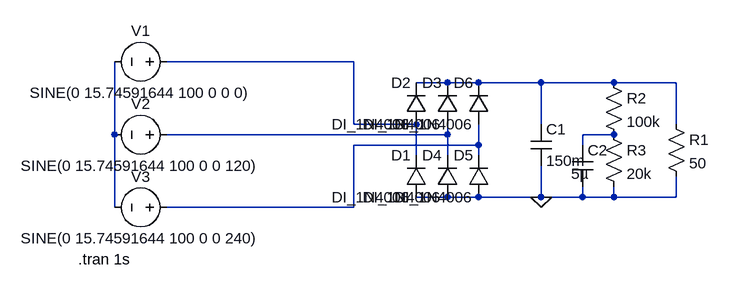
[diagram p0: schematic 3p ensretter.asc]
3p ensretter.asc, the LTspice schematic file:
Version 4
SHEET 1 880 680
WIRE 64 -48 -224 -48
WIRE 208 -16 160 -16
WIRE 256 -16 208 -16
WIRE 352 -16 256 -16
WIRE 464 -16 352 -16
WIRE 560 -16 464 -16
WIRE 64 48 64 -48
WIRE 160 48 64 48
WIRE 352 48 352 -16
WIRE 560 48 560 -16
WIRE -304 64 -304 -48
WIRE 208 64 208 48
WIRE 208 64 -224 64
WIRE 464 64 416 64
WIRE 256 80 256 48
WIRE 256 80 64 80
WIRE 416 80 416 64
WIRE 160 96 160 48
WIRE 208 96 208 64
WIRE 256 96 256 80
WIRE 208 160 160 160
WIRE 256 160 208 160
WIRE 352 160 352 112
WIRE 352 160 256 160
WIRE 416 160 416 144
WIRE 416 160 352 160
WIRE 464 160 464 144
WIRE 464 160 416 160
WIRE 560 160 560 128
WIRE 560 160 464 160
WIRE -304 176 -304 64
WIRE 64 176 64 80
WIRE 64 176 -224 176
FLAG 352 160 0
SYMBOL diode 176 48 R180
WINDOW 0 24 64 Left 2
WINDOW 3 24 0 Left 2
SYMATTR InstName D2
SYMATTR Value DI_1N4006
SYMBOL diode 224 48 R180
WINDOW 0 24 64 Left 2
WINDOW 3 24 0 Left 2
SYMATTR InstName D3
SYMATTR Value DI_1N4006
SYMBOL diode 272 48 R180
WINDOW 0 24 64 Left 2
WINDOW 3 24 0 Left 2
SYMATTR InstName D6
SYMATTR Value DI_1N4006
SYMBOL cap 336 48 R0
SYMATTR InstName C1
SYMATTR Value 150m
SYMBOL res 544 32 R0
SYMATTR InstName R1
SYMATTR Value 50
SYMBOL res 448 -32 R0
SYMATTR InstName R2
SYMATTR Value 100k
SYMBOL res 448 48 R0
SYMATTR InstName R3
SYMATTR Value 20k
SYMBOL cap 400 80 R0
WINDOW 3 -2 44 Left 2
SYMATTR Value 5µ
SYMATTR InstName C2
SYMBOL voltage -208 -48 R90
WINDOW 0 -32 56 VBottom 2
WINDOW 3 32 56 VTop 2
WINDOW 123 0 0 Left 0
WINDOW 39 0 0 Left 0
SYMATTR InstName V1
SYMATTR Value SINE(0 15.74591644 100 0 0 0)
SYMBOL voltage -208 64 R90
WINDOW 0 -32 56 VBottom 2
WINDOW 3 32 56 VTop 2
WINDOW 123 0 0 Left 0
WINDOW 39 0 0 Left 0
SYMATTR InstName V2
SYMATTR Value SINE(0 15.74591644 100 0 0 120)
SYMBOL voltage -208 176 R90
WINDOW 0 -32 56 VBottom 2
WINDOW 3 32 56 VTop 2
WINDOW 123 0 0 Left 0
WINDOW 39 0 0 Left 0
SYMATTR InstName V3
SYMATTR Value SINE(0 15.74591644 100 0 0 240)
SYMBOL diode 176 160 R180
WINDOW 0 24 64 Left 2
WINDOW 3 24 0 Left 2
SYMATTR InstName D1
SYMATTR Value DI_1N4006
SYMBOL diode 224 160 R180
WINDOW 0 24 64 Left 2
WINDOW 3 24 0 Left 2
SYMATTR InstName D4
SYMATTR Value DI_1N4006
SYMBOL diode 272 160 R180
WINDOW 0 24 64 Left 2
WINDOW 3 24 0 Left 2
SYMATTR InstName D5
SYMATTR Value DI_1N4006
TEXT -360 256 Left 2 !.tran 1s

The netlist it stands for:
* 3p ensretter.asc
D2 N001 N002 DI_1N4006
D3 N004 N002 DI_1N4006
D6 N006 N002 DI_1N4006
C1 N002 0 150m
R1 N002 0 50
R2 N002 N005 100k
R3 N005 0 20k
C2 N005 0 5µ
V1 N001 N003 SINE(0 15.74591644 100 0 0 0)
V2 N004 N003 SINE(0 15.74591644 100 0 0 120)
V3 N006 N003 SINE(0 15.74591644 100 0 0 240)
D1 0 N001 DI_1N4006
D4 0 N004 DI_1N4006
D5 0 N006 DI_1N4006
.model D D
.lib standard.dio
.tran 1s
.backanno
.end